# Altium schematic sheet hexbot_运动传感器.SchDoc
size A4
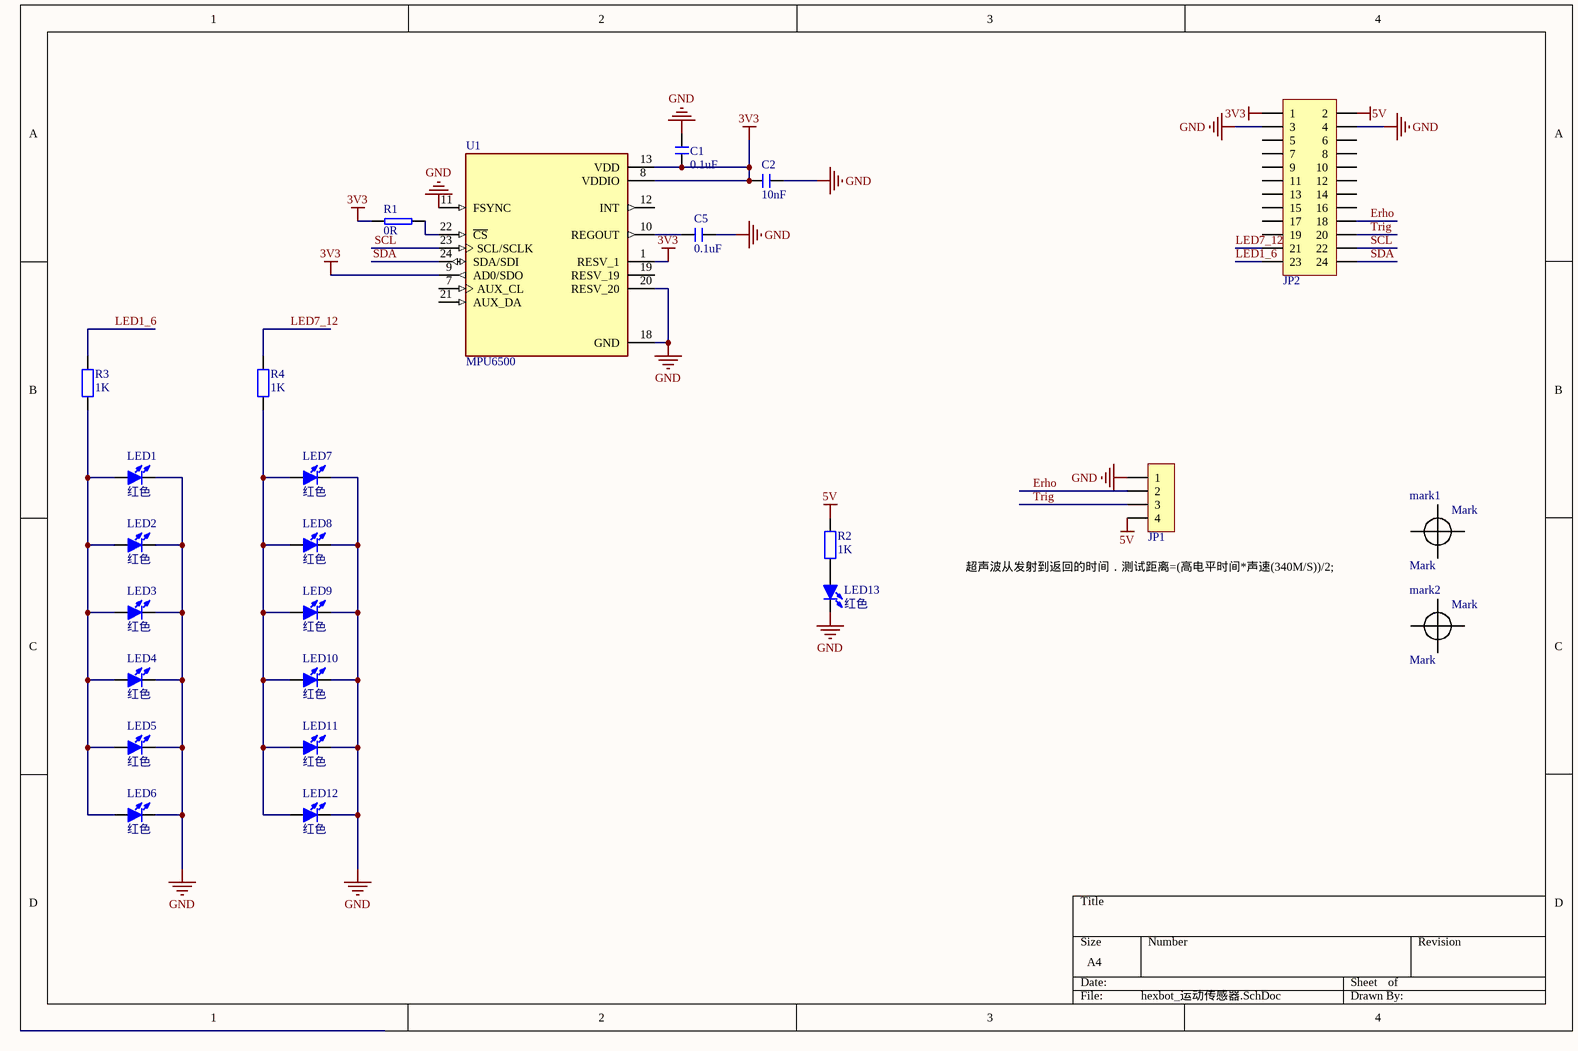
[diagram p0: hexbot_运动传感器.SchDoc]

## Parts
C1  0.1uF  [C 0603_L]
C2  10nF  [C 0603_L]
C5  0.1uF  [C 0603_L]
JP1  HDR-1X4  [HDR2.54-LI-4P]  (value not drawn)
JP2  Header 2X11  [HDR2.54-WI-2x12P]  (value not drawn)
LED1  红色  [LED 0603R]
LED2  红色  [LED 0603R]
LED3  红色  [LED 0603R]
LED4  红色  [LED 0603R]
LED5  红色  [LED 0603R]
LED6  红色  [LED 0603R]
LED7  红色  [LED 0603R]
LED8  红色  [LED 0603R]
LED9  红色  [LED 0603R]
LED10  红色  [LED 0603R]
LED11  红色  [LED 0603R]
LED12  红色  [LED 0603R]
LED13  红色  [LED 0603R]
mark1  Mark  [Mark]  (no BOM)
mark2  Mark  [Mark]  (no BOM)
R1  0R  [0603]
R2  1K  [R 0805_L]
R3  1K  [R 0603_L]
R4  1K  [R 0603_L]
U1  MPU6500  [MPU-6050]

## Nets
3V3: C1.2 C2.2 JP2.1 R1.1 U1.1(RESV_1) U1.8(VDDIO) U1.9(AD0/SDO) U1.13(VDD)
5V: JP1.4 JP2.2 R2.2
GND: C1.1 C2.1 C5.1 JP1.1 JP2.3 JP2.4 LED1.2(K) LED2.2(K) LED3.2(K) LED4.2(K) LED5.2(K) LED6.2(K) LED7.2(K) LED8.2(K) LED9.2(K) LED10.2(K) LED11.2(K) LED12.2(K) LED13.2(K) U1.11(FSYNC) U1.18(GND) U1.20(RESV_20)
Erho: JP1.2 JP2.18
LED1_6: JP2.23 R3.2
LED7_12: JP2.21 R4.2
SCL: JP2.22 U1.23(SCL/SCLK)
SDA: JP2.24 U1.24(SDA/SDI)
Trig: JP1.3 JP2.20
NetC5_2: C5.2 U1.10(REGOUT)
NetLED1_1: LED1.1(A) LED2.1(A) LED3.1(A) LED4.1(A) LED5.1(A) LED6.1(A) R3.1
NetLED7_1: LED7.1(A) LED8.1(A) LED9.1(A) LED10.1(A) LED11.1(A) LED12.1(A) R4.1
NetLED13_1: LED13.1(A) R2.1
NetR1_2: R1.2 U1.22(~{CS})

Not connected (* = marked no-connect by the designer): JP2 5 6 7 8 9 10 11 12 13 14 15 16 17 19; U1 7(AUX_CL) 12(INT) 19(RESV_19) 21(AUX_DA)

## Notes on the sheet
- (near JP1) 超声波从发射到返回的时间．测试距离=(高电平时间*声速(340M/S))/2;

## Library data of the parts
C1 C2 C5 = C: 贴片电容; BOM名称: 无极性贴片电容; 淘宝ID: 封装库来自淘宝 ID：黄晶宝石; 联系售后，技术支持: https://shop463601444.taobao.com; 唯一出售店铺网址: https://shop463601444.taobao.com
JP1 = Header 4: 4P接插件; 版权归属: 封装库来自淘宝 ID：黄晶宝石; BOM名称: 4P接插件; 学习资源: https://shop463601444.taobao.com
JP2 = Header 12X2: 12*2P接插件; 版权归属: 封装库来自淘宝卖家 ID：黄晶宝石; BOM名称: 12*2P接插件; 学习资源: https://shop463601444.taobao.com
LED1-LED13 = LED-SMD: 贴片LED; 版权归属: 封装库来自淘宝 ID：黄晶宝石; BOM名称: 贴片LED; 学习资源: https://shop463601444.taobao.com
R1 = RES2
R2-R4 = R: 贴片电阻; 版权归属: 来自淘宝 ID：黄晶宝石; 封装库来自淘宝卖家 ID：黄晶宝石: 其他店铺购入均为盗版，不享受售后技术支持服务，请立即申请退款; BOM名称: 贴片电阻; 联系售后: https://shop463601444.taobao.com
U1 = MPU-9250: Accelerometer, Gyroscope, Magnetometer, 9 Axis Sensor IÂ²C, SPI Output; MF: TDK InvenSense; SnapEDA_Link: https://www.snapeda.com/parts/MPU-9250/TDK%20InvenSense/view-part/4652549/?ref=snap; Value: *; MP: MPU-9250; Availability: Unavailable; Package: TFQFN-24 TDK InvenSense; Price: None